# Altium project Power.PrjPcb
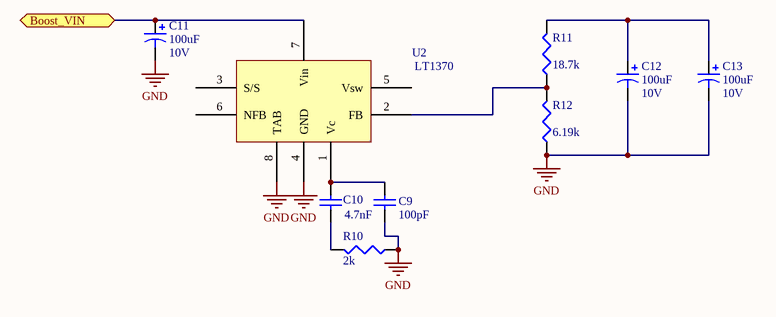
[diagram p0: Power_Supply_Regulation.SchDoc]
3 sheets, 31 parts. Net scope: flat (ports and power ports of the same name join across sheets).
Board file: Power.PcbDoc
Sheets:
  Top_Level.SchDoc
  Power_Supply_Regulation.SchDoc
  LiPo_Charger.SchDoc

## Sheet Top_Level.SchDoc: AusBubble : Power : Top Level
size A4; DrawnBy: WR, ND; DocumentNumber: 1; Revision: A; SheetNumber: 1; SheetTotal: 4

## Sheet Power_Supply_Regulation.SchDoc: AusBubble : Power : Power Supply Regulation
size A4; DrawnBy: WR, ND; DocumentNumber: 2; Revision: A; SheetNumber: 2; SheetTotal: 4

### Parts
C9  value 100pF  [1608[0603]]  (hidden comment: Cap Semi)
C10  value 4.7nF  [1608[0603]]  (hidden comment: Cap Semi)
C11  value 100uF  Voltage: 10V  [1812]  (hidden comment: Cap Pol3)
C12  value 100uF  Voltage: 10V  [1812]  (hidden comment: Cap Pol3)
C13  value 100uF  Voltage: 10V  [1812]  (hidden comment: Cap Pol3)
R10  value 2k  [J1-0603]  (hidden comment: Res3)
R11  value 18.7k  [J1-0603]  (hidden comment: Res3)
R12  value 6.19k  [J1-0603]  (hidden comment: Res3)
U2  LT1370  [TO127P1520-8L]

### Ports
Boost_VIN

### Nets
GND: C9.1 C11.2 C12.2 C13.2 R10.1 R12.1 U2.4(GND) U2.8(TAB)
NetC9_2: C9.2 C10.2 U2.1(Vc)
NetC10_1: C10.1 R10.2
NetC11_1: C11.1 U2.7(Vin) ; port Boost_VIN
NetC12_1: C12.1 C13.1 R11.2
NetR11_1: R11.1 R12.2 U2.2(FB)

Not connected (* = marked no-connect by the designer): U2 3(S/S) 5(Vsw) 6(NFB)

### Library data of the parts
C9 C10 = Cap Semi: Capacitor (Semiconductor SIM Model); Published: 8-Jun-2000; LatestRevisionDate: 29-May-2009; LatestRevisionNote: IPC-7351 Footprint Added.; PackageReference: C1206; Publisher: Altium Limited; PackageDescription: Chip Capacitor
C11-C13 = Cap Pol3: Polarized Capacitor (Surface Mount); Part: AVX TPSD107M010R0100; Published: 8-Jun-2000; LatestRevisionDate: 29-May-2009; LatestRevisionNote: IPC-7351 Footprint Added.; PackageReference: C0805; Publisher: Altium Limited; PackageDescription: Chip Capacitor
R10-R12 = Res3: Resistor; Published: 8-Jun-2000; LatestRevisionDate: 29-May-2009; LatestRevisionNote: IPC-7351 Footprint Added.; PackageReference: J1-0603; Publisher: Altium Limited; PackageDescription: Chip Resistor
U2 = LT1370: 500kHz High Efficiency 6A Switching Regulator

## Sheet LiPo_Charger.SchDoc
size A4; DocumentNumber: 4; SheetNumber: 4; SheetTotal: 4
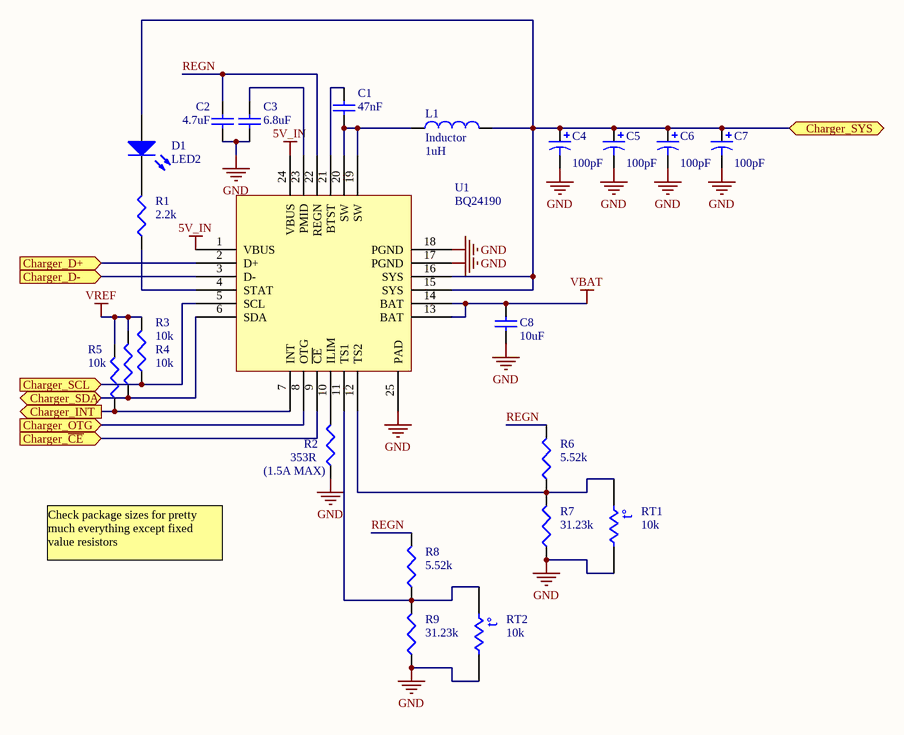
[diagram p1: LiPo_Charger.SchDoc]

### Parts
C1  value 47nF  [1608[0603]]  (hidden comment: Cap Semi)
C2  value 4.7uF  [1608[0603]]  (hidden comment: Cap Semi)
C3  value 6.8uF  [1608[0603]]  (hidden comment: Cap Semi)
C4  value 100pF  [C0805]  (hidden comment: Cap Pol3)
C5  value 100pF  [C0805]  (hidden comment: Cap Pol3)
C6  value 100pF  [C0805]  (hidden comment: Cap Pol3)
C7  value 100pF  [C0805]  (hidden comment: Cap Pol3)
C8  value 10uF  [1608[0603]]  (hidden comment: Cap Semi)
D1  LED2  [3.2X1.6X1.1]
L1  Inductor  value 1uH  [0603]
R1  value 2.2k  [J1-0603]  (hidden comment: Res3)
R2  (1.5A MAX)  value 353R  [J1-0603]
R3  value 10k  [J1-0603]
R4  value 10k  [J1-0603]
R5  value 10k  [J1-0603]
R6  value 5.52k  [J1-0603]  (hidden comment: Res3)
R7  value 31.23k  [J1-0603]  (hidden comment: Res3)
R8  value 5.52k  [J1-0603]  (hidden comment: Res3)
R9  value 31.23k  [J1-0603]  (hidden comment: Res3)
RT1  value 10k  [6-0805_N]  (hidden comment: Res Thermal)
RT2  value 10k  [6-0805_N]  (hidden comment: Res Thermal)
U1  BQ24190  [QFN50P400X400-24V9L]

### Ports
Charger_D+ (in), Charger_D- (in), Charger_INT (out), Charger_OTG (in), Charger_SCL (in), Charger_SDA (bidir), Charger_SYS, Charger_~{CE} (in)

### Nets
5V_IN: U1.1(VBUS) U1.24(VBUS)
GND: C2.1 C3.1 C4.2 C5.2 C6.2 C7.2 C8.2 R2.1 R7.1 R9.1 RT1.2 RT2.2 U1.17(PGND) U1.18(PGND) U1.25(PAD)
VBAT: C8.1 U1.13(BAT) U1.14(BAT)
VREF: R3.2 R4.2 R5.2
REGN: C2.2 R6.2 R8.2 U1.22(REGN)
NetC1_1: C1.1 L1.1 U1.19(SW) U1.20(SW)
NetC1_2: C1.2 U1.21(BTST)
NetC3_2: C3.2 U1.23(PMID)
NetC4_1: C4.1 C5.1 C6.1 C7.1 D1.1(A) L1.2 U1.15(SYS) U1.16(SYS) ; port Charger_SYS
NetD1_2: D1.2(K) R1.2
NetR1_1: R1.1 U1.4(STAT)
NetR2_2: R2.2 U1.10(ILIM)
NetR3_1: R3.1 U1.5(SCL) ; port Charger_SCL
NetR4_1: R4.1 U1.6(SDA) ; port Charger_SDA
NetR5_1: R5.1 U1.7(INT) ; port Charger_INT
NetR6_1: R6.1 R7.2 RT1.1 U1.12(TS2)
NetR8_1: R8.1 R9.2 RT2.1 U1.11(TS1)
NetU1_2: U1.2(D+) ; port Charger_D+
NetU1_3: U1.3(D-) ; port Charger_D-
NetU1_8: U1.8(OTG) ; port Charger_OTG
NetU1_9: U1.9(~{CE}) ; port Charger_~{CE}

### Notes on the sheet
- Check package sizes for pretty much everything except fixed value resistors
- (in symbol Res Thermal) t°

### Library data of the parts
C1-C3 C8 = Cap Semi: Capacitor (Semiconductor SIM Model); Published: 8-Jun-2000; LatestRevisionDate: 29-May-2009; LatestRevisionNote: IPC-7351 Footprint Added.; PackageReference: C1206; Publisher: Altium Limited; PackageDescription: Chip Capacitor
C4-C7 = Cap Pol3: Polarized Capacitor (Surface Mount); Published: 8-Jun-2000; LatestRevisionDate: 29-May-2009; LatestRevisionNote: IPC-7351 Footprint Added.; PackageReference: C0805; Publisher: Altium Limited; PackageDescription: Chip Capacitor
D1 = LED2: Typical RED, GREEN, YELLOW, AMBER GaAs LED; Published: 8-Jun-2000; LatestRevisionDate: 17-Jul-2002; LatestRevisionNote: Re-released for DXP Platform.; PackageVersion: Feb-2002; PackageReference: 3.2X1.6X1.1; Publisher: Altium Limited; PackageDescription: SM LED; 2 Flat Leads
L1 = Inductor: Code_IEC: 1005; Published: 8-Jun-2000; LatestRevisionDate: 29-May-2009; LatestRevisionNote: IPC-7351 Footprint Added.; PackageReference: 0402-A; Publisher: Altium Limited; PackageDescription: Chip Inductor; Code_JEITA: 0402
R1-R9 = Res3: Resistor; Published: 8-Jun-2000; LatestRevisionDate: 29-May-2009; LatestRevisionNote: IPC-7351 Footprint Added.; PackageReference: J1-0603; Publisher: Altium Limited; PackageDescription: Chip Resistor
RT1 RT2 = Res Thermal: Thermistor; Published: 24-Mar-1999; LatestRevisionDate: 29-May-2009; LatestRevisionNote: IPC-7351 Footprint Added.; PackageVersion: Mar-2003; PackageReference: 6-0805; Publisher: Altium Limited; PackageDescription: Chip Resistor 0805 Case Size; Code_IPC: RESC2012
U1 = BQ24190: I2C Controlled 4.5A Single Cell LiPo Charger w/ USB

## Nets that join several sheets
GND: Power_Supply_Regulation (8 pins), LiPo_Charger (15 pins)